# Altium schematic sheet Sheet1.SchDoc
size A4; SheetNumber: 1; SheetTotal: 1
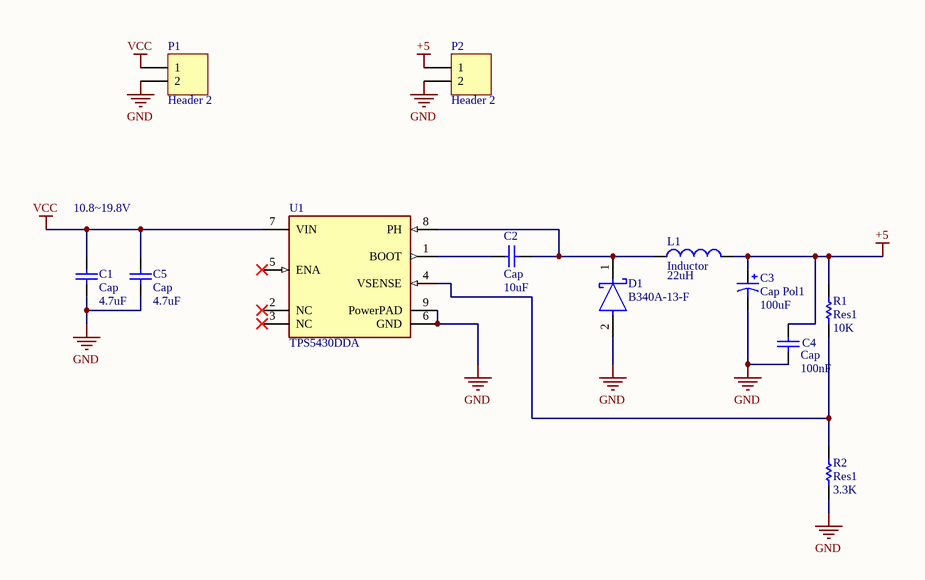
[diagram p0: Sheet1.SchDoc]

## Parts
C1  Cap  value 4.7uF  [RAD-0.3]
C2  Cap  value 10uF  [RAD-0.3]
C3  Cap Pol1  value 100uF  [RB7.6-15]
C4  Cap  value 100nF  [RAD-0.3]
C5  Cap  value 4.7uF  [RAD-0.3]
D1  B340A-13-F  [FP-SMA-MFG]
L1  Inductor  value 22uH  [0402-A]
P1  Header 2  [HDR1X2]
P2  Header 2  [HDR1X2]
R1  Res1  value 10K  [AXIAL-0.3]
R2  Res1  value 3.3K  [AXIAL-0.3]
U1  TPS5430DDA  [FP-DDA0008J-MFG]

## Nets
+5: C3.1 C4.2 L1.2 P2.1 R1.2
GND: C1.1 C3.2 C4.1 C5.1 D1.2(A) P1.2 P2.2 R2.1 U1.6(GND) U1.9(PowerPAD)
VCC: C1.2 C5.2 P1.1 U1.7(VIN)
NetC2_1: C2.1 D1.1(C) L1.1 U1.8(PH)
NetC2_2: C2.2 U1.1(BOOT)
NetR1_1: R1.1 R2.2 U1.4(VSENSE)

Not connected (* = marked no-connect by the designer): U1 2(NC)* 3(NC)* 5(ENA)*

## Notes on the sheet
- 10.8~19.8V

## Library data of the parts
C1 C2 C4 C5 = Cap: Capacitor; Published: 8-Jun-2000; LatestRevisionDate: 17-Jul-2002; LatestRevisionNote: Re-released for DXP Platform.; PackageReference: RAD-0.3; Publisher: Altium Limited; PackageDescription: Radial Cap, Thru-Hole; 2 Leads; 0.3 in Pin Spacing
C3 = Cap Pol1: Polarized Capacitor (Radial); Published: 8-Jun-2000; LatestRevisionDate: 17-Jul-2002; LatestRevisionNote: Re-released for DXP Platform.; PackageReference: RB7.6-15; Publisher: Altium Limited; PackageDescription: Polarized Capacitor (Radial); 2 Leads
D1 = CMP-1667-00003-3: DIODE SCHOTTKY 40V 3A SMA; Max Forward Surge Current (Ifsm): 80A; Forward Voltage: 500mV; Polarity: Standard; Max Reverse Current: 500uA; Capacitance: 250pF; Element Configuration: Single; Mount: Surface Mount; Output Current: 3A; Radiation Hardening: No; Width: 2.92mm; Current Rating: 3A; Termination: SMD/SMT; Voltage: 40V; Series: -; Max Operating Temperature: 125°C; Current: 3A; Max Repetitive Reverse Voltage (Vrrm): 40V; Min Operating Temperature: -55°C; REACH SVHC: No SVHC; Number of Pins: 2; Average Rectified Current: 3A; Contact Plating: Tin; RoHS Compliant: Yes; Max Reverse Voltage (DC): 40V; Packaging: Tape and Reel; Height: 2.3mm; Length: 4.6mm; Case/Package: SMA; Weight: 0.002258oz; Peak Non-Repetitive Surge Current: 80A; Package Quantity: 5000; Lead Free: Lead Free; Forward Current: 3A; Voltage Rating (DC): 40V
L1 = Inductor: Code_IEC: 1005; Published: 8-Jun-2000; LatestRevisionDate: 29-May-2009; LatestRevisionNote: IPC-7351 Footprint Added.; PackageReference: 0402-A; Publisher: Altium Limited; PackageDescription: Chip Inductor; Code_JEITA: 0402
P1 P2 = Header 2: Header, 2-Pin; LatestRevisionDate: 17-Jul-2002; LatestRevisionNote: Re-released for DXP Platform.; Publisher: Altium Limited
R1 R2 = Res1: Resistor; Published: 8-Jun-2000; LatestRevisionDate: 17-Jul-2002; LatestRevisionNote: Re-released for DXP Platform.; PackageReference: AXIAL-0.3; Publisher: Altium Limited; PackageDescription: Axial Device, Thru-Hole; 2 Leads; 0.3 in Pin Spacing
U1 = CMP-2000-04960-2: IC REG BUCK ADJUSTABLE 3A 8SOPWR; Manufacturer: Texas Instruments; Max Junction Temp: +125°C; Max Supply Voltage: 36V; Switching Frequency: 500kHz; Output Type: AdjustableProgrammable; Standoff Height: 0mm; Output Voltage: 1.23-31V; Max Duty Cycle: 89%; Description: Buck Switching Regulator IC Positive Adjustable 1.221V 1 Output 3A 8-PowerSOIC (0.154", 3.90mm Width); Nominal Supply Current: 3mA; Min Supply Voltage: 5.5V; Number Of Outputs: 1; Temperature: -40°C to +125°C; Temperature Range High: +125°C; Manufacturer Part Number: TPS5430DDA; Device Class L3: Voltage Regulators - Switching; Mouser Description: Voltage Regulators - Switching Regulators 5.5 to 36V Input 3A Step Dwn Converter; Switching Topology: Buck; ComponentLink2URL: http://www.ti.com/lit/ds/symlink/tps5431.pdf; ComponentLink2Description: Datasheet; Device Class L2: Power Management ICs; Device Class L1: Integrated Circuits (ICs); Digikey Description: IC REG BUCK ADJUSTABLE 3A 8SOPWR; RoHS: TRUE; Octopart: https://octopart.com/tps5430dda-texas+instruments-589977; Output Current: 3A; Automotive: No; Lead Free: Yes; Category: IC; Package: DDA0008J; Temperature Range Low: -40°C; Height: 1.7mm